# EAGLE design arduinoFMShield (EAGLE 6.5.0)
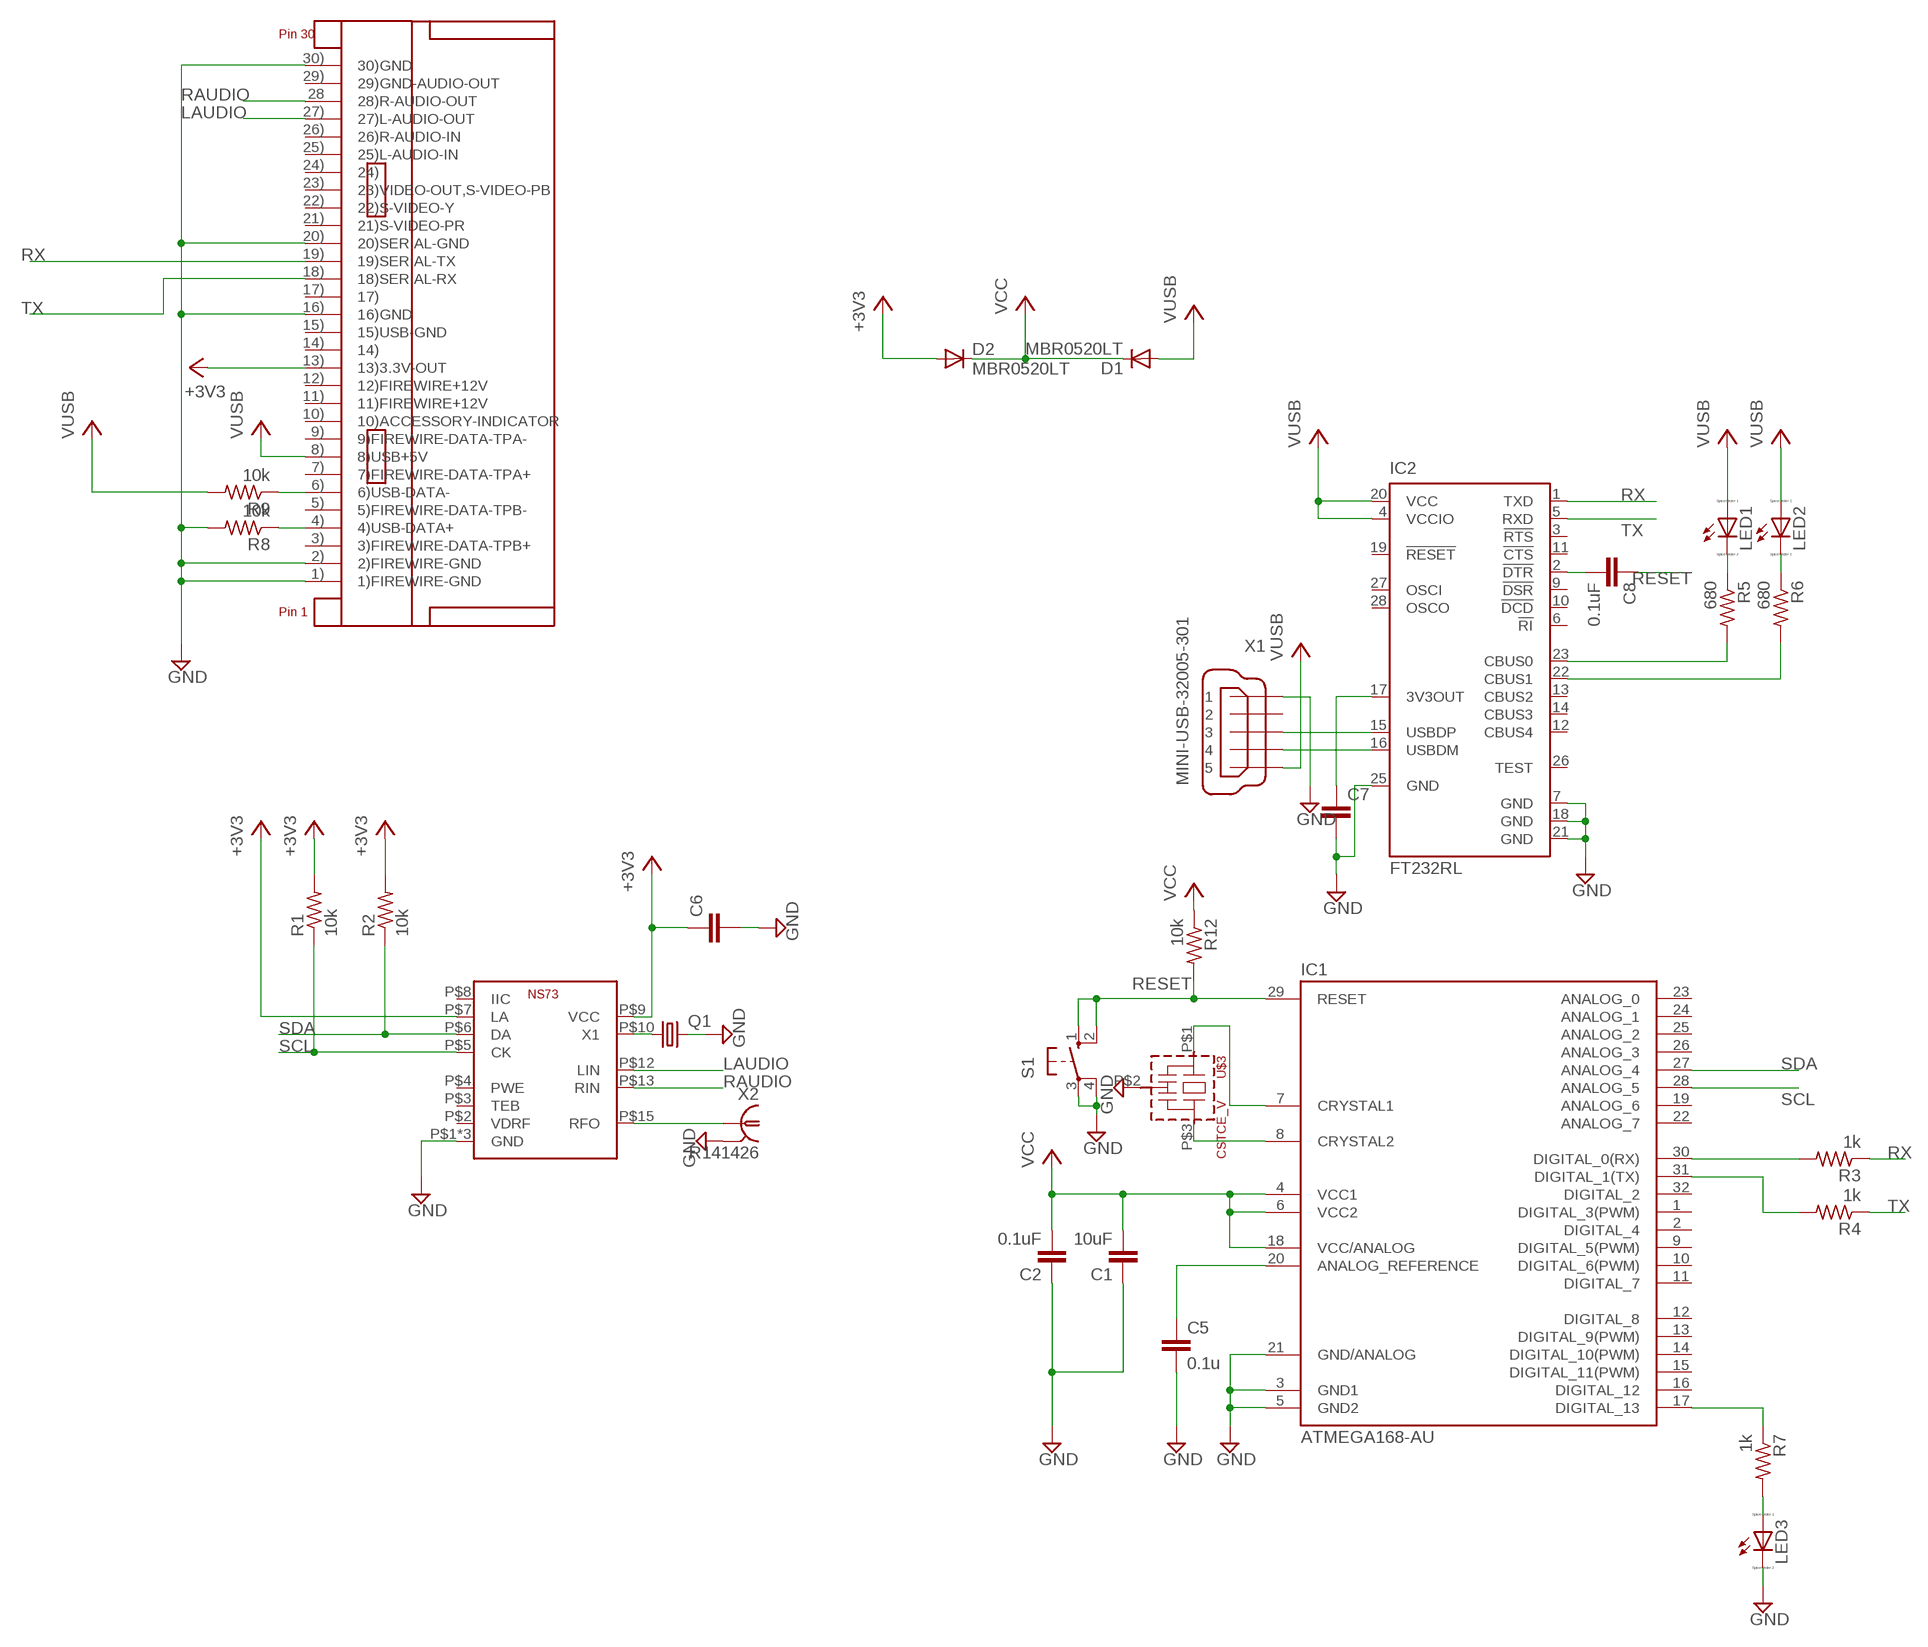
[diagram p0: schematic, sheet 1]

## Parts
C1  10uF  C-EUC1206  [C1206]
C2  0.1uF  C-EUC1206  [C1206]
C5  0.1u  C-EUC1206  [C1206]
C6  C-EUC1206  [C1206]
C7  C-EUC1206  [C1206]
C8  0.1uF  C-EUC1206  [C1206]
D1  MBR0520LT  [SOD123]
D2  MBR0520LT  [SOD123]
IC1  ATMEGA168-AU  [TQFP32-08]
IC2  FT232RL  [SSOP28]
LED1  LED_ESML0603  [LED_SML0603]
LED2  LED_ESML0603  [LED_SML0603]
LED3  LED_ESML0603  [LED_SML0603]
Q1  CRYSTALTC26H  [TC26H]
R1  10k  R-US_R1206  [R1206]
R2  10k  R-US_R1206  [R1206]
R3  1k  R-US_R1206  [R1206]
R4  1k  R-US_R1206  [R1206]
R5  680  R-US_R0805  [R0805]
R6  680  R-US_R0805  [R0805]
R7  1k  R-US_R1206  [R1206]
R8  10k  R-US_R1206  [R1206]
R9  10k  R-US_R1206  [R1206]
R12  10k  R-US_R1206  [R1206]
S1  10-XX  [B3F-10XX]
U$1  NS73  [NS73]
U$2  IPOD-DOCK-CONNECTOR  [IPOD_CONNECTOR]
U$3  CSTCE_V  [CSTCE_V]
X1  MINI-USB-32005-301  [32005-301]
X2  R141426  [R141426]

## Nets
+3V3: C6.1 D2.A R1.2 R2.2 U$1.P$7(LA) U$1.P$9(VCC) U$2.13)(13)3.3V-OUT)
GND: C1.1 C2.1 C5.2 C6.2 C7.2 IC1.3(GND1) IC1.5(GND2) IC1.21(GND/ANALOG) IC2.7(GND) IC2.18(GND) IC2.21(GND) IC2.25(GND) LED3.C Q1.2 R8.2 S1.3(P) S1.4(P1) U$1.P$1(GND) U$1.P$11(GND) U$1.P$14(GND) U$2.1)(1)FIREWIRE-GND) U$2.2)(2)FIREWIRE-GND) U$2.16)(16)GND) U$2.20)(20)SERIAL-GND) U$2.30)(30)GND) U$3.P$2(VSS) X1.1 X2.2 X2.3 X2.4 X2.5
LAUDIO: U$1.P$12(LIN) U$2.27)(27)L-AUDIO-OUT)
N$1: U$1.P$15(RFO) X2.1
N$2: IC2.15(USBDP) X1.3
N$3: IC2.16(USBDM) X1.4
N$4: IC2.23(CBUS0) R5.2
N$5: IC2.22(CBUS1) R6.2
N$6: Q1.1 U$1.P$10(X1)
N$7: R8.1 U$2.4)(4)USB-DATA+)
N$8: R9.1 U$2.6)(6)USB-DATA-)
N$11: C7.1 IC2.17(3V3OUT)
N$12: IC1.30(DIGITAL_0(RX)) R3.2
N$13: IC1.31(DIGITAL_1(TX)) R4.2
N$14: C5.1 IC1.20(ANALOG_REFERENCE)
N$15: LED1.C R5.1
N$16: C8.2 IC2.2(!DTR)
N$17: LED2.C R6.1
N$18: IC1.17(DIGITAL_13) R7.1
N$19: LED3.A R7.2
N$20: IC1.7(CRYSTAL1) U$3.P$1
N$22: IC1.8(CRYSTAL2) U$3.P$3
RAUDIO: U$1.P$13(RIN) U$2.28(28)R-AUDIO-OUT)
RESET: C8.1 IC1.29(RESET) R12.2 S1.1(S) S1.2(S1)
RX: IC2.1(TXD) R3.1 U$2.19)(19)SERIAL-TX)
SCL: IC1.28(ANALOG_5) R1.1 U$1.P$5(CK)
SDA: IC1.27(ANALOG_4) R2.1 U$1.P$6(DA)
TX: IC2.5(RXD) R4.1 U$2.18)(18)SERIAL-RX)
VCC: C1.2 C2.2 D1.C D2.C IC1.4(VCC1) IC1.6(VCC2) IC1.18(VCC/ANALOG) R12.1
VUSB: D1.A IC2.4(VCCIO) IC2.20(VCC) LED1.A LED2.A R9.2 U$2.8)(8)USB+5V) X1.5
Unconnected: IC1.1(DIGITAL_3(PWM)) IC1.2(DIGITAL_4) IC1.9(DIGITAL_5(PWM)) IC1.10(DIGITAL_6(PWM)) IC1.11(DIGITAL_7) IC1.12(DIGITAL_8) IC1.13(DIGITAL_9(PWM)) IC1.14(DIGITAL_10(PWM)) IC1.15(DIGITAL_11(PWM)) IC1.16(DIGITAL_12) IC1.19(ANALOG_6) IC1.22(ANALOG_7) IC1.23(ANALOG_0) IC1.24(ANALOG_1) IC1.25(ANALOG_2) IC1.26(ANALOG_3) IC1.32(DIGITAL_2) IC2.3(!RTS) IC2.6(!RI) IC2.9(!DSR) IC2.10(!DCD) IC2.11(!CTS) IC2.12(CBUS4) IC2.13(CBUS2) IC2.14(CBUS3) IC2.19(!RESET) IC2.26(TEST) IC2.27(OSCI) IC2.28(OSCO) U$1.P$2(VDRF) U$1.P$3(TEB) U$1.P$4(PWE) U$1.P$8(IIC) U$2.3)(3)FIREWIRE-DATA-TPB+) U$2.5)(5)FIREWIRE-DATA-TPB-) U$2.7)(7)FIREWIRE-DATA-TPA+) U$2.9)(9)FIREWIRE-DATA-TPA-) U$2.10)(10)ACCESSORY-INDICATOR) U$2.11)(11)FIREWIRE+12V) U$2.12)(12)FIREWIRE+12V) U$2.14) U$2.15)(15)USB-GND) U$2.17) U$2.21)(21)S-VIDEO-PR) U$2.22)(22)S-VIDEO-Y) U$2.23)(23)VIDEO-OUT,S-VIDEO-PB) U$2.24) U$2.25)(25)L-AUDIO-IN) U$2.26)(26)R-AUDIO-IN) U$2.29)(29)GND-AUDIO-OUT) X1.2

## Library data of the parts
C1 C2 C5-C8 = rcl:C-EU: CAPACITOR, European symbol
D1 D2 = diode:MBR0520LT: SCHOTTKY BARRIER RECTIFIER Source: http://onsemi.com .. MBR0520LT1-D.pdf
IC1 = Arduino-AVR:ATMEGA168
IC2 = ftdichip:FT232R: Source: http://www.ftdichip.com/Documents/DataSheets/DS_FT232R_v104.pdf; MPN: FT232RL; OC_FARNELL: 1146032; OC_NEWARK: 91K9918
LED1-LED3 = eagle-ltspice:LED_E: LED Source: http://www.osram.convergy.de Source: www.luxeon.com Source: www.kingbright.com; SPICEMODEL: NONE; SPICEPREFIX: D; SPICETYPE: diode
Q1 = crystal:CRYSTAL: CRYSTAL; OC_FARNELL: unknown; OC_NEWARK: unknown
R1-R9 R12 = rcl:R-US_: RESISTOR, American symbol
S1 = switch-omron:10-XX: OMRON SWITCH; MPN: B3F-1000; OC_FARNELL: 176432; OC_NEWARK: 36M3542
U$1 = FMTrans_miscellaneous:NS73
U$2 = ipod_con:IPOD-DOCK-CONNECTOR
U$3 = murata-resonators:CSTCE_V
X1 = con-cypressindustries:MINI-USB-: MINI USB-B Conector Source: www.cypressindustries.com; OC_FARNELL: unknown; OC_NEWARK: unknown
X2 = con-coax:R141426: BNC COAX CONNECTOR Radiall 50/75 Ohm Spoerle; MF: FARNELL; MPN: R141426161; OC_FARNELL: 4195115; OC_NEWARK: 14J7919

## Board
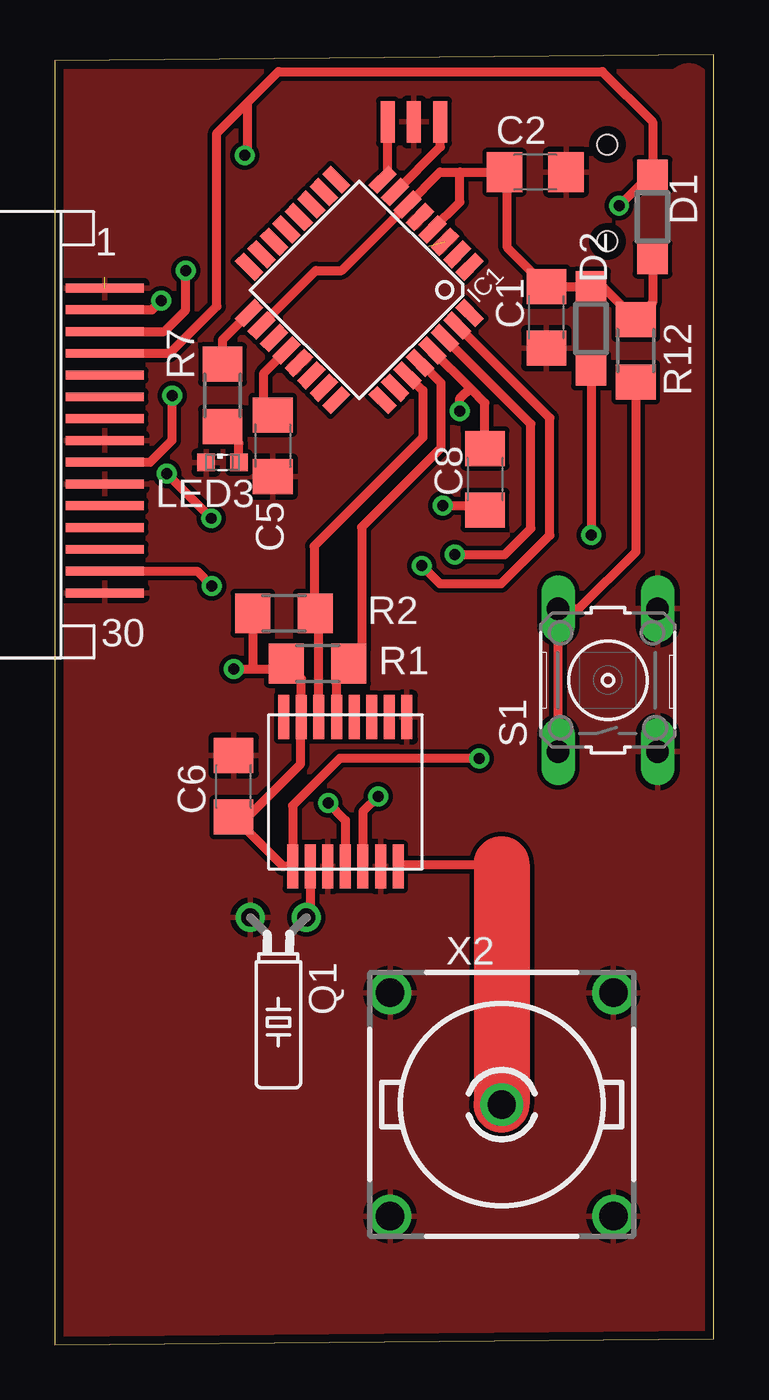
[diagram p1: board, top side]
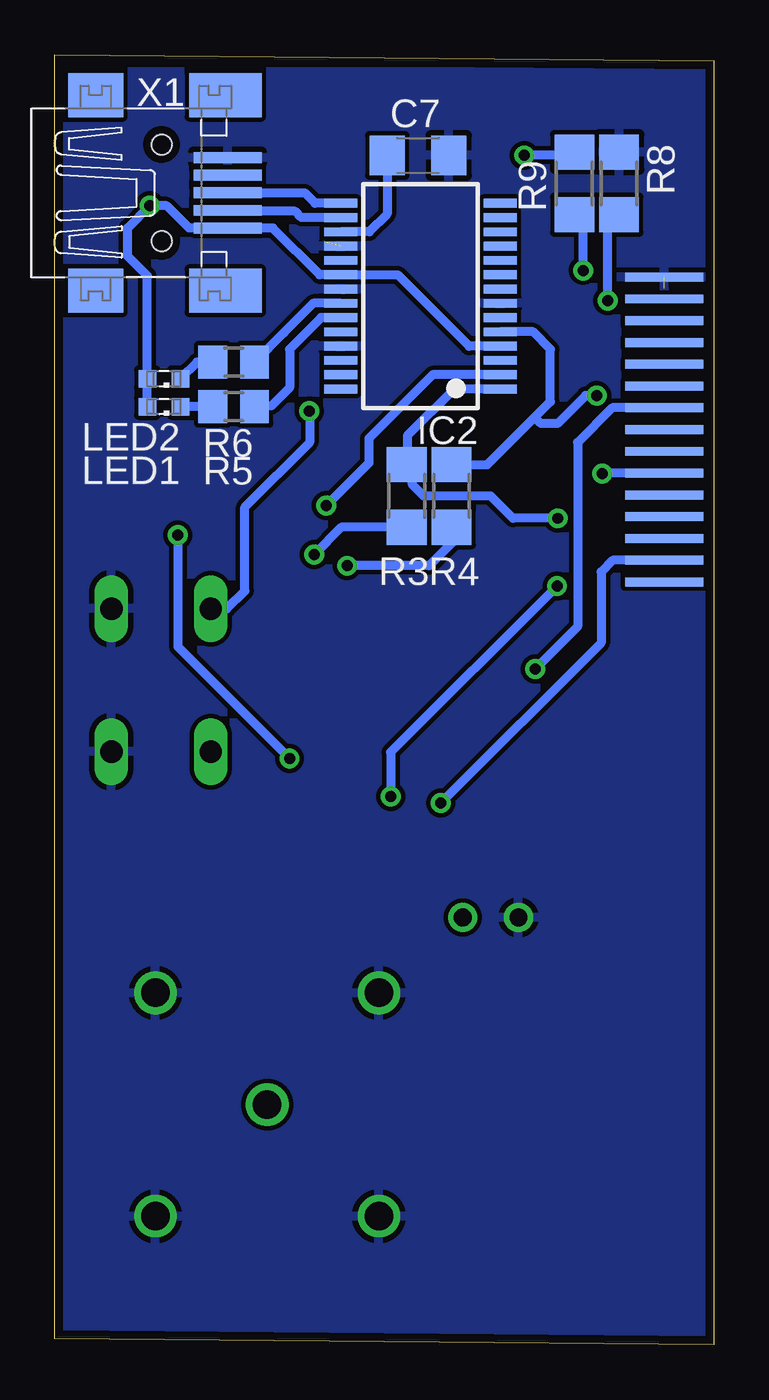
[diagram p2: board, bottom side, seen from below]

Size 29.97 x 58.67 mm. Coordinates in mm from the lower left corner, seen from the top.
Outline: 0,0 29.97,0.25 29.97,58.67 0,58.42 0,0
Copper layers (1*16): Top 0.035mm / dielectric 1.5mm / Bottom 0.035mm
Design rules "default *": minimum track width 8mil, minimum drill 13mil, track to track 7mil, track to pad 7mil, pad to pad 7mil, via to via 7mil, smd to smd 6mil, copper to edge 15mil, drill to drill 8mil, minimum pad ring 10mil, minimum via ring 8mil, stop-mask expansion 4mil, vias tented up to drill 0mil, thermal gap 10mil

### Footprints (pad centres in the part's own frame; a part is rotated, then mirrored left to right if it is on the bottom)
C1206 = smd 1.6 x 1.8: 1 -1.4,0; 2 1.4,0
SOD123 = smd 1.4 x 1.4: A 1.9,0; C -1.9,0
TQFP32-08 = smd 1.27 x 0.559: 1 -4.293,2.8; 2 -4.293,2; 3 -4.293,1.2; 4 -4.293,0.4; 5 -4.293,-0.4; 6 -4.293,-1.2; 7 -4.293,-2; 8 -4.293,-2.8; 17 4.293,-2.8; 18 4.293,-2; 19 4.293,-1.2; 20 4.293,-0.4; 21 4.293,0.4; 22 4.293,1.2; 23 4.293,2; 24 4.293,2.8 | smd 0.559 x 1.27: 9 -2.8,-4.293; 10 -2,-4.293; 11 -1.2,-4.293; 12 -0.4,-4.293; 13 0.4,-4.293; 14 1.2,-4.293; 15 2,-4.293; 16 2.8,-4.293; 25 2.8,4.293; 26 2,4.293; 27 1.2,4.293; 28 0.4,4.293; 29 -0.4,4.293; 30 -1.2,4.293; 31 -2,4.293; 32 -2.8,4.293
SSOP28 = smd 0.4 x 1.5: 1 -4.225,-3.625; 2 -3.575,-3.625; 3 -2.925,-3.625; 4 -2.275,-3.625; 5 -1.625,-3.625; 6 -0.975,-3.625; 7 -0.325,-3.625; 8 0.325,-3.625; 9 0.975,-3.625; 10 1.625,-3.625; 11 2.275,-3.625; 12 2.925,-3.625; 13 3.575,-3.625; 14 4.225,-3.625; 15 4.225,3.625; 16 3.575,3.625; 17 2.925,3.625; 18 2.275,3.625; 19 1.625,3.625; 20 0.975,3.625; 21 0.325,3.625; 22 -0.325,3.625; 23 -0.975,3.625; 24 -1.625,3.625; 25 -2.275,3.625; 26 -2.925,3.625; 27 -3.575,3.625; 28 -4.225,3.625
LED_SML0603 = smd 0.8 x 0.8: A 0.75,0; C -0.75,0
TC26H = drill 0.813: 1 -1.27,0; 2 1.27,0
R1206 = smd 1.6 x 1.803: 1 -1.422,0; 2 1.422,0
R0805 = smd 1.3 x 1.5: 1 -0.95,0; 2 0.95,0
B3F-10XX = drill 1.016 long: 1 -3.251,2.261; 2 3.251,2.261; 3 -3.251,-2.261; 4 3.251,-2.261
NS73 = smd 2 x 0.5: P$1 3.4,-2.8; P$2 3.4,-2; P$3 3.4,-1.2; P$4 3.4,-0.4; P$5 3.4,0.4; P$6 3.4,1.2; P$7 3.4,2; P$8 3.4,2.8; P$9 -3.4,2.4; P$10 -3.4,1.6; P$11 -3.4,0.8; P$12 -3.4,0; P$13 -3.4,-0.8; P$14 -3.4,-1.6; P$15 -3.4,-2.4
IPOD_CONNECTOR = smd 3.556 x 0.406 bottom: 1) -1.981,-7.925; 3) -1.981,-6.934; 5) -1.981,-5.944; 7) -1.981,-4.953; 9) -1.981,-3.962; 11) -1.981,-2.972; 13) -1.981,-1.981; 15) -1.981,-0.991; 17) -1.981,0; 19) -1.981,0.991; 21) -1.981,1.981; 23) -1.981,2.972; 25) -1.981,3.962; 27) -1.981,4.953; 29) -1.981,5.944 | smd 3.556 x 0.406: 2) -1.981,-7.429; 4) -1.981,-6.439; 6) -1.981,-5.448; 8) -1.981,-4.458; 10) -1.981,-3.467; 12) -1.981,-2.477; 14) -1.981,-1.486; 16) -1.981,-0.495; 18) -1.981,0.495; 20) -1.981,1.486; 22) -1.981,2.477; 24) -1.981,3.467; 26) -1.981,4.458; 28 -1.981,5.448; 30) -1.981,6.439
CSTCE_V = smd 0.635 x 1.9: P$1 0,0; P$2 1.2,0; P$3 2.4,0
32005-301 = smd 3.1 x 0.5: 1 3,1.6; 2 3,0.8; 3 3,0; 4 3,-0.8; 5 3,-1.6 | smd 2.5 x 2: M1 -3,-4.45; M2 -3,4.45 | smd 3.3 x 2: M3 2.9,4.45; M4 2.9,-4.45 | hole 0.9: 0,2.2; 0,-2.2
R141426 = drill 1.295: 1 0,0; 2 5.08,5.08; 3 -5.08,5.08; 4 -5.08,-5.08; 5 5.08,-5.08

### Placement (x,y rotation side)
C1  22.35,46.74 90 top
C2  21.84,53.34 180 top
C5  9.91,40.89 270 top
C6  8.13,25.4 90 top
C7  13.46,54.1 0 bottom
C8  19.56,39.37 270 top
D1  27.18,51.31 90 top
D2  24.38,46.23 270 top
IC1  13.85,47.98 225 top
IC2  13.35,47.7 90 bottom
LED1  25.02,42.67 180 bottom
LED2  25.02,43.94 180 bottom
LED3  7.62,40.13 0 top
Q1  10.16,19.43 180 top
R1  11.94,30.99 180 top
R2  10.41,33.27 180 top
R3  13.97,38.61 270 bottom
R4  11.94,38.61 270 bottom
R5  21.84,42.67 0 bottom
R6  21.84,44.7 0 bottom
R7  7.62,43.18 270 top
R8  4.32,52.83 90 bottom
R9  6.35,52.83 90 bottom
R12  26.42,45.21 270 top
S1  25.15,30.23 90 top
U$1  13.21,25.15 90 top
U$2  0.28,40.64 180 top
U$3  17.53,55.63 180 top
X1  25.12,52.4 0 bottom
X2  20.32,10.92 0 top

### Tracks (layer width: path | path; a pad name or v marks a point on that pad's centre or on a via)
+3V3  (via drill 0.5)
  Top 0.406: v8.13,30.73 8.89,30.73 | 8.89,30.73 10.26,30.73 R1.2 11.21,30.3 U$1.P$7 11.18,28.51 11.18,26.42 8.76,24 C6.1 10.38,21.75 U$1.P$9 10.81,24.52 12.95,26.67 v19.3,26.67 | R2.2 8.99,30.84 8.89,30.73 | D2.A v24.38,36.83
  Bottom 0.406: U$2.13) 4.62,42.62 6.2,41.05 6.2,32.66 v8.13,30.73 | v24.38,36.83 24.38,31.75 v19.3,26.67
GND  (2 unrouted)
  pour Top (isolate 0.203): 0.25,57.91 28.19,57.91 arc-90 29.46,57.91 29.46,0.51 0.51,0.25 arc-90 0.25,0.51
  pour Bottom (isolate 0.203): 0.25,57.91 29.46,57.91 29.46,0.25 0.25,0.25
LAUDIO  (via drill 0.5)
  Top 0.406: v12.42,24.64 13.21,23.85 U$1.P$12
  Bottom 0.406: U$2.27) 4.6,35.69 5.13,35.15 5.13,31.93 v12.42,24.64
N$1
  Top 0.406: U$1.P$15 15.71,21.84 20.32,21.84
  Top 2.54: 20.32,21.84 X2.1
N$2
  Bottom 0.406: IC2.15 18.14,51.92 18.62,52.4 X1.3
N$3
  Bottom 0.406: IC2.16 18.76,51.27 19.05,51.56 21.07,51.56 X1.4
N$4
  Bottom 0.406: IC2.23 17.87,46.72 19.3,45.29 19.3,43.54 20.14,42.7 20.87,42.7 R5.2
N$5
  Bottom 0.406: IC2.22 18.23,47.37 19.56,46.05 19.56,46.04 R6.2
N$6
  Top 0.406: U$1.P$10 11.61,19.61 Q1.1
N$7  (via drill 0.5)
  Top 0.406: U$2.4) 4.41,47.08 v4.83,47.5
  Bottom 0.406: v4.83,47.5 4.83,50.9 R8.1
N$8  (via drill 0.5)
  Top 0.406: U$2.6) 4.97,46.09 5.94,47.07 v5.94,48.87
  Bottom 0.406: v5.94,48.87 5.94,51 R9.1
N$11
  Bottom 0.406: C7.1 14.86,51.43 15.67,50.62 IC2.17
N$12  (via drill 0.5)
  Top 0.406: v18.19,35.94 20.45,35.94 21.64,37.13 21.64,41.89 IC1.30
  Bottom 0.406: R3.2 16.94,37.19 v18.19,35.94
N$13  (via drill 0.5)
  Top 0.406: v16.69,35.43 17.5,34.62 20.29,34.62 22.5,36.83 22.5,42.16 IC1.31
  Bottom 0.406: R4.2 11.94,36.45 12.95,35.43 v16.69,35.43
N$14
  Top 0.406: IC1.20 9.47,44.17 9.47,41.96 C5.1
N$15
  Bottom 0.406: R5.1 LED1.C
N$16  (via drill 0.5)
  Top 0.406: v17.63,38.18 19.35,38.18 C8.2
  Bottom 0.406: IC2.2 12.8,44.12 15.7,41.22 15.7,40.11 v17.63,38.18
N$17
  Bottom 0.406: R6.1 23.51,44.7 LED2.C
N$18
  Top 0.406: R7.1 7.62,45.72 IC1.17
N$19
  Top 0.406: LED3.A 8.37,41.01 R7.2
N$20
  Top 0.406: IC1.7 17.53,54.49 U$3.P$1
N$22
  Top 0.406: IC1.8 15.13,53.22 U$3.P$3
RAUDIO  (via drill 0.5)
  Top 0.406: U$2.28 6.46,35.19 v7.14,34.52 | v14.71,24.94 14.01,24.24 U$1.P$13
  Bottom 0.406: v7.14,34.52 14.71,26.95 v14.71,24.94
RESET  (via drill 0.5)
  Top 0.406: C8.1 19.56,42.84 18.88,43.52 | 18.88,43.52 IC1.29 | v18.41,42.47 18.41,43.05 18.88,43.52 | R12.2 26.42,36.07 23.82,33.48 S1.2 S1.1
  Bottom 0.406: v18.41,42.47 18.39,42.44 18.39,41.05 21.34,38.1 21.34,34.29 22.15,33.48 S1.2
RX  (via drill 0.5)
  Top 0.406: v5.08,39.62 v7.11,37.59
  Bottom 0.406: IC2.1 11.82,43.47 13.95,41.35 13.95,40.05 R3.1 13.72,39.78 13.72,39.12 13.21,38.61 10.16,38.61 9.14,37.59 v7.11,37.59 | U$2.19) 5.05,39.65 v5.08,39.62
SCL
  Top 0.406: U$1.P$5 12.81,30.44 R1.1 13.95,31.57 13.95,37.19 17.55,40.79 17.55,43.76 16.65,44.67 IC1.28
SDA
  Top 0.406: IC1.27 16.74,43.41 16.74,41.27 11.79,36.32 11.79,33.32 R2.1 12.01,33.1 U$1.P$6
TX  (via drill 0.5)
  Top 0.406: U$2.18) 4.33,40.15 5.33,41.15 v5.33,43.18
  Bottom 0.406: R4.1 10.31,40.03 8.15,42.19 | 8.15,42.19 7.44,42.9 7.44,45.29 8.23,46.08 IC2.5 | v5.33,43.18 5.84,43.18 7.11,41.91 7.87,41.91 8.15,42.19
VCC
  Top 0.406: 18.41,53.34 17.51,53.34 IC1.6 13.04,48.87 11.86,48.87 9.4,46.41 IC1.18 | 18.41,53.34 C2.2 20.57,53.21 20.57,49.91 C1.2 24.38,48.14 D2.C 24.92,48.13 R12.1 27.18,47.4 D1.C | IC1.4 18.41,51.98 18.41,53.34
VUSB  (via drill 0.5)
  Top 0.406: U$2.8) 5.22,45.1 7.37,47.24 7.37,55.12 8.76,56.52 | 8.76,56.52 10.16,57.91 24.89,57.91 27.18,55.63 D1.A 27.05,53.21 v25.65,51.82 | v8.64,54.1 8.76,54.23 8.76,56.52
  Bottom 0.254: R9.2 6.5,54.1
  Bottom 0.406: 21.11,50.8 20.07,50.8 17.94,48.67 IC2.20 14.38,48.67 11.13,45.42 IC2.4 | 21.11,50.8 X1.5 | 21.11,50.8 23.88,50.8 24.89,51.82 v25.65,51.82 26.67,50.8 26.67,49.53 25.77,48.63 LED2.A LED1.A | 6.5,54.1 v8.64,54.1